# Altium project LORA_NODE_PCB_Project.PrjPcb
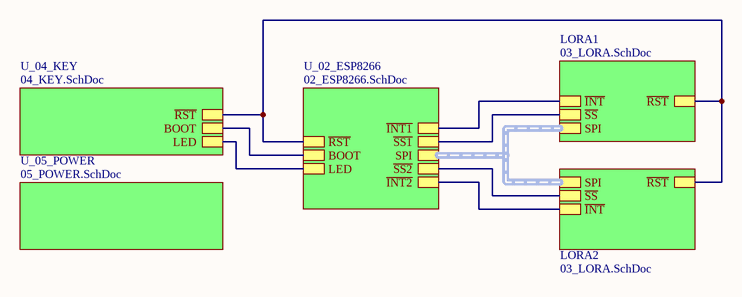
[diagram p0: 01_SYSTEM.SchDoc]
5 sheets, 109 parts. Net scope: hierarchical (ports join the sheet entries above them; power ports are global).
Board files: LORA_NODE.PcbDoc, LORA_NODE2.PcbDoc
Sheets:
  01_SYSTEM.SchDoc
    U_02_ESP8266 = 02_ESP8266.SchDoc
    LORA1 = 03_LORA.SchDoc
    LORA2 = 03_LORA.SchDoc
    U_04_KEY = 04_KEY.SchDoc
    U_05_POWER = 05_POWER.SchDoc

## Sheet 01_SYSTEM.SchDoc: LORA_NODE_SYSYTEM
size A4

### Sub-sheets
LORA1 = 03_LORA.SchDoc: SPI (harness SPI), ~{RST}, ~{SS}, ~{INT}
LORA2 = 03_LORA.SchDoc: SPI (harness SPI), ~{RST}, ~{SS}, ~{INT}
U_02_ESP8266 = 02_ESP8266.SchDoc: SPI (harness SPI), ~{RST}, ~{SS1}, ~{SS2}, BOOT, ~{INT1}, ~{INT2}, LED
U_04_KEY = 04_KEY.SchDoc: ~{RST}, BOOT, LED
U_05_POWER = 05_POWER.SchDoc: no entries

### Nets
DIO0: sheet U_02_ESP8266/~{INT2}, sheet LORA2/~{INT}
DIO0: sheet U_02_ESP8266/~{INT1}, sheet LORA1/~{INT}  [a separate net that carries the same name]
GPIO0: sheet U_02_ESP8266/BOOT, sheet U_04_KEY/BOOT
GPIO16: sheet U_02_ESP8266/LED, sheet U_04_KEY/LED
IO2: sheet U_02_ESP8266/~{SS2}, sheet LORA2/~{SS}
IO15: sheet U_02_ESP8266/~{SS1}, sheet LORA1/~{SS}
nRESET: sheet U_02_ESP8266/~{RST}, sheet LORA1/~{RST}, sheet LORA2/~{RST}, sheet U_04_KEY/~{RST}

### Buses and harness runs
harness sheet LORA1/SPI = sheet LORA2/SPI = sheet U_02_ESP8266/SPI

## Sheet 02_ESP8266.SchDoc
size A4
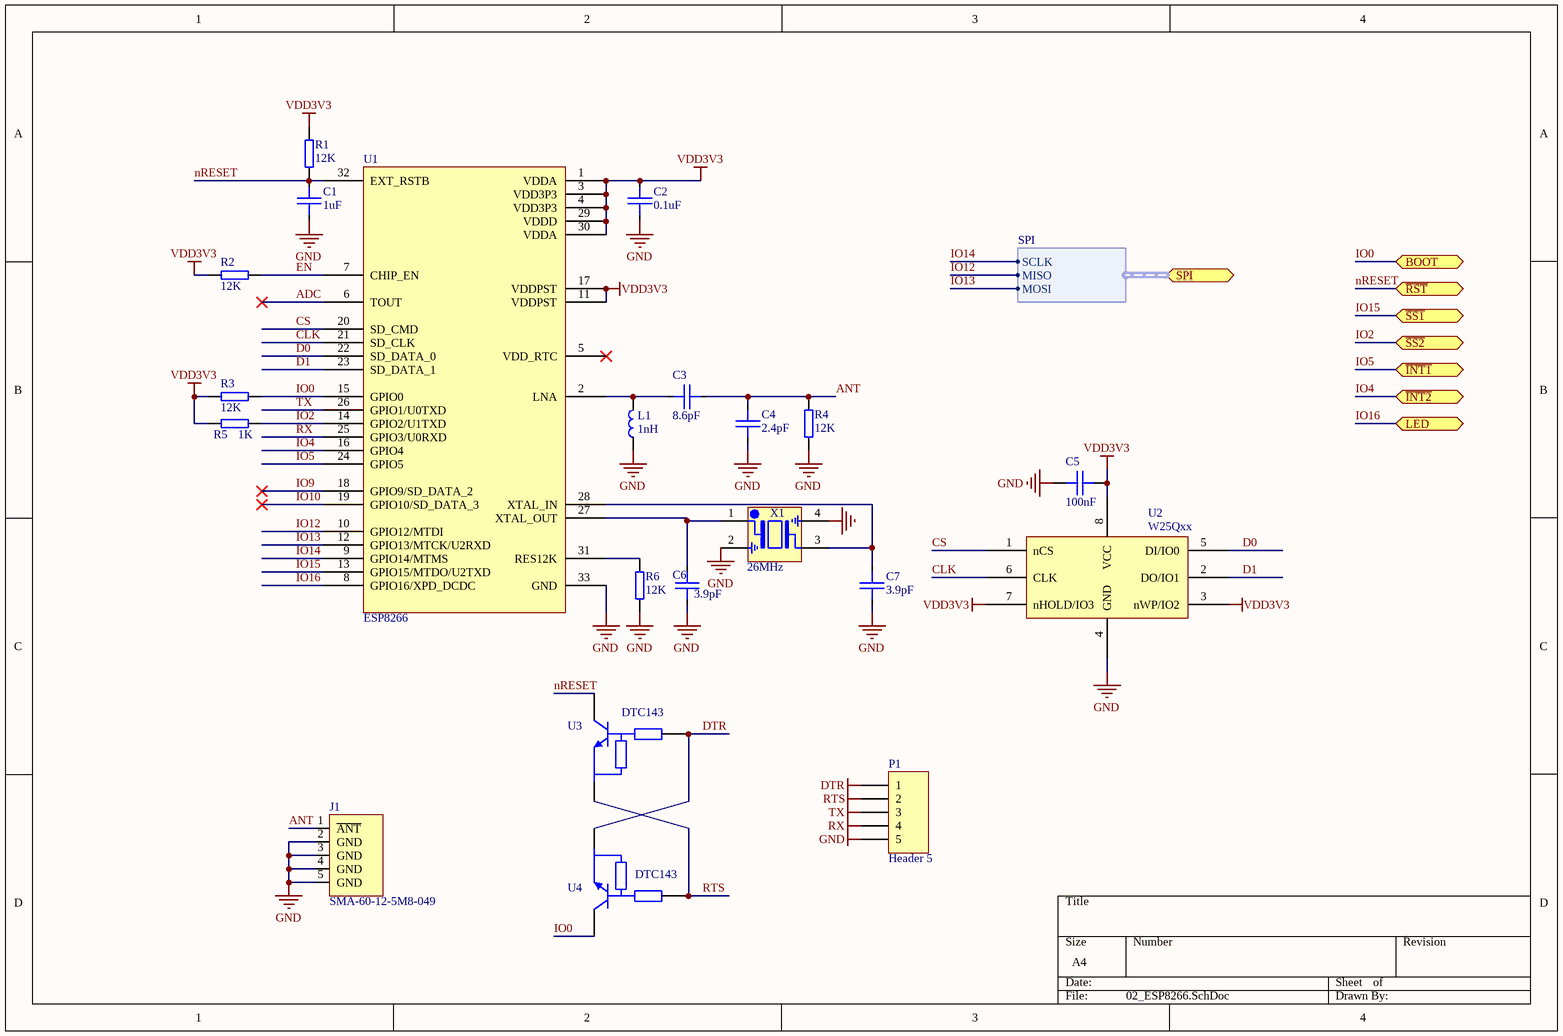
[diagram p1: 02_ESP8266.SchDoc]

### Parts
C1  1uF  [SMT_C_0402]
C2  0.1uF  [SMT_C_0402]
C3  8.6pF  [SMT_C_0402]
C4  2.4pF  [SMT_C_0402]
C5  100nF  [SMT_C_0402]
C6  3.9pF  [SMT_C_0402]
C7  3.9pF  [SMT_C_0402]
J1  SMA-60-12-5M8-049  [SMA-60-12-5M8-049]
L1  1nH  [SMT_L_0402]
P1  Header 5  [HDR1X5]
R1  12K  [SMT_R_0402]
R2  12K  [SMT_R_0402]
R3  12K  [SMT_R_0402]
R4  12K  [SMT_R_0402]
R5  1K  [SMT_R_0402]
R6  12K  [SMT_R_0402]
U1  ESP8266  [QFN32]
U2  W25Qxx  [SOP-8]
U3  DTC143  [SOT23-3]
U4  DTC143  [SOT23-3]
X1  26MHz  [SMT_XTAL_3225]

### Ports
BOOT, LED, SPI (harness SPI), ~{INT1}, ~{INT2}, ~{RST}, ~{SS1}, ~{SS2}

### Harnesses
SPI: MISO, MOSI, SCLK

### Nets
DTR: P1.1 U3.1(B) U4.2(E)
GND: C1.2 C2.2 C4.2 C5.2 C6.2 C7.2 J1.2(GND) J1.3(GND) J1.4(GND) J1.5(GND) L1.2 P1.5 R4.1 R6.2 U1.33(GND) U2.4(GND) X1.2(GND) X1.4(GND)
RTS: P1.2 U3.2(E) U4.1(B)
RX: P1.4 U1.25(GPIO3/U0RXD)
TX: P1.3 U1.26(GPIO1/U0TXD)
VDD3V3: C2.1 C5.1 R1.2 R2.2 R3.2 R5.2 U1.1(VDDA) U1.3(VDD3P3) U1.4(VDD3P3) U1.11(VDDPST) U1.17(VDDPST) U1.29(VDDD) U1.30(VDDA) U2.3(nWP/IO2) U2.7(nHOLD/IO3) U2.8(VCC)
ADC: U1.6(TOUT)
ANT: C3.1 C4.1 J1.1(~{ANT}) R4.2
CLK: U1.21(SD_CLK) U2.6(CLK)
CS: U1.20(SD_CMD) U2.1(nCS)
D0: U1.22(SD_DATA_0) U2.5(DI/IO0)
D1: U1.23(SD_DATA_1) U2.2(DO/IO1)
EN: R2.1 U1.7(CHIP_EN)
IO0: R3.1 U1.15(GPIO0) U4.3(C) ; port BOOT  [project net GPIO0]
IO2: R5.1 U1.14(GPIO2/U1TXD) ; port ~{SS2}
IO4: U1.16(GPIO4) ; port ~{INT2}  [project net DIO0]
IO5: U1.24(GPIO5) ; port ~{INT1}  [project net DIO0]
IO9: U1.18(GPIO9/SD_DATA_2)
IO10: U1.19(GPIO10/SD_DATA_3)
IO12: U1.10(GPIO12/MTDI) ; port SPI.MISO
IO13: U1.12(GPIO13/MTCK/U2RXD) ; port SPI.MOSI
IO14: U1.9(GPIO14/MTMS) ; port SPI.SCLK
IO15: U1.13(GPIO15/MTDO/U2TXD) ; port ~{SS1}
IO16: U1.8(GPIO16/XPD_DCDC) ; port LED  [project net GPIO16]
nRESET: C1.1 R1.1 U1.32(EXT_RSTB) U3.3(C) ; port ~{RST}
NetC3_2: C3.2 L1.1 U1.2(LNA)
NetC6_1: C6.1 U1.27(XTAL_OUT) X1.1(IN/OUT)
NetC7_1: C7.1 U1.28(XTAL_IN) X1.3(IN/OUT)
NetR6_1: R6.1 U1.31(RES12K)

Not connected (* = marked no-connect by the designer): U1 5(VDD_RTC)*

### Library data of the parts
C1-C4 C6 C7 = SMT_C_0402_1: Surface mount capacitor 0402
C5 = SMT_C_0402: Surface mount capacitor 0402
J1 = SMA-60-12-5M8-049: sma 60-12-5M8-049
L1 = SMT_L_0402: Surface mount inductor 0402
P1 = Header 5: Header, 5-Pin; LatestRevisionDate: 17-Jul-2002; LatestRevisionNote: Re-released for DXP Platform.; Publisher: Altium Limited
R1-R6 = SMT_R_0402: Surface mount resistor 0402
U2 = W25Qxx: Serial flash memory with dual and quad SPI
U3 U4 = DTC143: Digital transistors (built-in resistors)
X1 = SMT_XTAL_PASSIVE: Passive crystal

## Sheet 03_LORA.SchDoc
size A4
Used 2 times, as channels LORA1, LORA2. Parts and nets are listed once, with the designators drawn on the sheet.
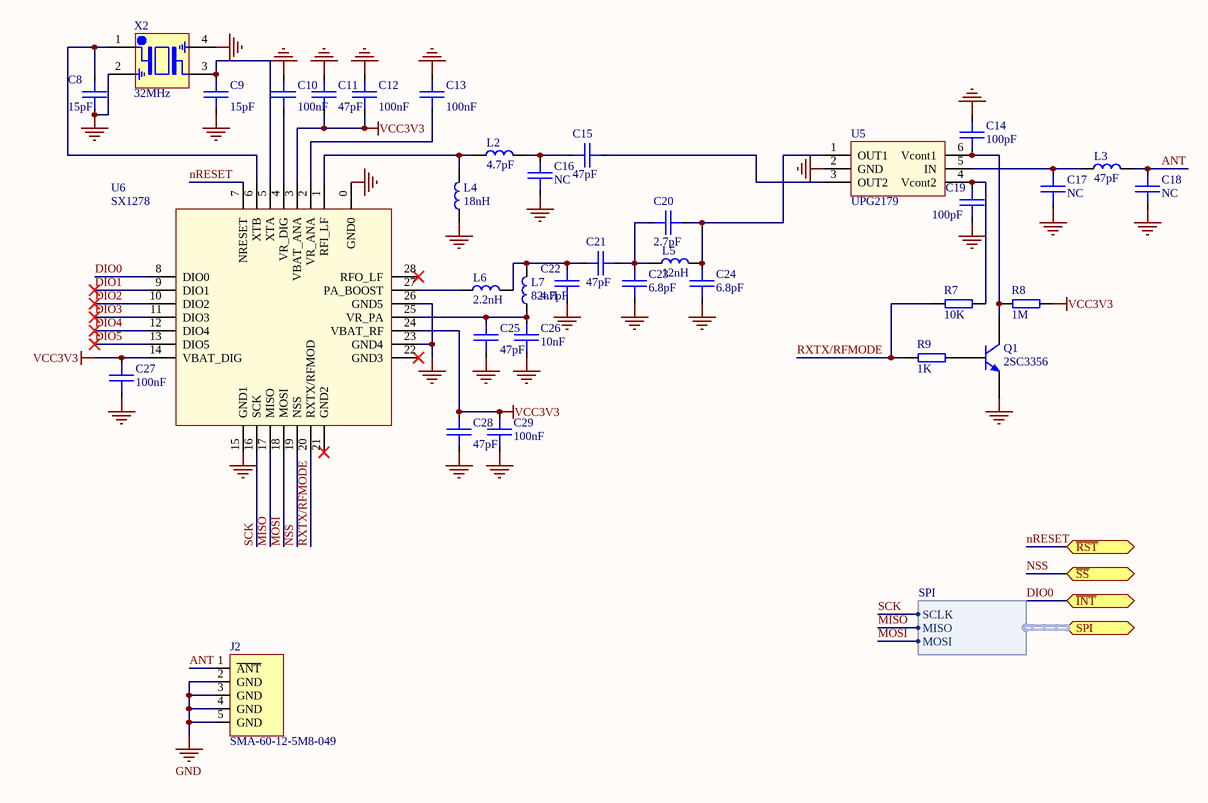
[diagram p2: 03_LORA.SchDoc]

### Parts
C8  15pF  [SMT_C_0402]
C9  15pF  [SMT_C_0402]
C10  100nF  [SMT_C_0402]
C11  47pF  [SMT_C_0402]
C12  100nF  [SMT_C_0402]
C13  100nF  [SMT_C_0402]
C14  100pF  [SMT_C_0402]
C15  47pF  [SMT_C_0402]
C16  NC  [SMT_C_0402]
C17  NC  [SMT_C_0402]
C18  NC  [SMT_C_0402]
C19  100pF  [SMT_C_0402]
C20  2.7pF  [SMT_C_0402]
C21  47pF  [SMT_C_0402]
C22  4.7pF  [SMT_C_0402]
C23  6.8pF  [SMT_C_0402]
C24  6.8pF  [SMT_C_0402]
C25  47pF  [SMT_C_0402]
C26  10nF  [SMT_C_0402]
C27  100nF  [SMT_C_0402]
C28  47pF  [SMT_C_0402]
C29  100nF  [SMT_C_0402]
J2  SMA-60-12-5M8-049  [SMA-60-12-5M8-049]
L2  4.7pF  [SMT_L_0402]
L3  47pF  [SMT_L_0402]
L4  18nH  [SMT_L_0402]
L5  12nH  [SMT_L_0402]
L6  2.2nH  [SMT_L_0402]
L7  82nH  [SMT_L_0402]
Q1  2SC3356  [SOT-23S]
R7  10K  [SMT_R_0402]
R8  1M  [SMT_R_0402]
R9  1K  [SMT_R_0402]
U5  UPG2179  [SC70-6]
U6  SX1278  [QFN28-6x6]
X2  32MHz  [SMT_XTAL_3225]

### Ports
SPI (harness SPI), ~{INT}, ~{RST}, ~{SS}

### Harnesses
SPI: MISO, MOSI, SCLK

### Nets
GND: C8.1 C9.1 C10.2 C11.1 C12.2 C13.2 C14.2 C16.1 C17.1 C18.1 C19.1 C22.1 C23.1 C24.1 C25.1 C26.1 C27.2 C28.1 C29.1 J2.2(GND) J2.3(GND) J2.4(GND) J2.5(GND) L4.2 Q1.2(E) U5.2(GND) U6.0(GND0) U6.15(GND1) U6.23(GND4) U6.26(GND5) X2.2(GND) X2.4(GND)
VCC3V3: C11.2 C12.1 C27.1 C28.2 C29.2 R8.2 U6.3(VBAT_ANA) U6.14(VBAT_DIG) U6.24(VBAT_RF)
ANT: C18.2 J2.1(~{ANT}) L3.1
DIO0: U6.8(DIO0) ; port ~{INT}
DIO1: U6.9(DIO1)
DIO2: U6.10(DIO2)
DIO3: U6.11(DIO3)
DIO4: U6.12(DIO4)
DIO5: U6.13(DIO5)
MISO: U6.17(MISO) ; port SPI.MISO
MOSI: U6.18(MOSI) ; port SPI.MOSI
nRESET: U6.7(NRESET) ; port ~{RST}
NSS: U6.19(NSS) ; port ~{SS}
RXTX/RFMODE: R7.1 R9.1 U6.20(RXTX/RFMOD)
SCK: U6.16(SCK) ; port SPI.SCLK
NetC8_2: C8.2 U6.6(XTB) X2.1(IN/OUT)
NetC9_2: C9.2 U6.5(XTA) X2.3(IN/OUT)
NetC10_1: C10.1 U6.4(VR_DIG)
NetC13_1: C13.1 U6.2(VR_ANA)
NetC14_1: C14.1 Q1.3(C) R8.1 U5.6(Vcont1)
NetC15_1: C15.1 U5.3(OUT2)
NetC15_2: C15.2 C16.2 L2.1
NetC17_2: C17.2 L3.2 U5.5(IN)
NetC19_2: C19.2 R7.2 U5.4(Vcont2)
NetC20_1: C20.1 C21.2 C23.2 L5.2
NetC20_2: C20.2 C24.2 L5.1 U5.1(OUT1)
NetC21_1: C21.1 C22.2 L6.1 L7.1
NetC25_2: C25.2 C26.2 L7.2 U6.25(VR_PA)
NetL2_2: L2.2 L4.1 U6.1(RFI_LF)
NetL6_2: L6.2 U6.27(PA_BOOST)
NetQ1_1: Q1.1(B) R9.2

Not connected (* = marked no-connect by the designer): U6 21(GND2)* 22(GND3)* 28(RFO_LF)*

### Channels
LORA1: designators end in _LORA1; ports ~{INT}=DIO0 ~{RST}=nRESET ~{SS}=IO15
LORA2: designators end in _LORA2; ports ~{INT}=DIO0 ~{RST}=nRESET ~{SS}=IO2

### Library data of the parts
C8-C29 = SMT_C_0402_1: Surface mount capacitor 0402
J2 = SMA-60-12-5M8-049: sma 60-12-5M8-049
L2-L7 = SMT_L_0402: Surface mount inductor 0402
Q1 = NPN: NPN Bipolar Transistor; Published: 8-Jun-2000; LatestRevisionDate: 17-Jul-2002; LatestRevisionNote: Re-released for DXP Platform.; PackageReference: TO-226-AA; Publisher: Altium Limited; PackageDescription: TO, Flat Index; 3 In-Line, Axial Leads; Body Dia. 4.8mm; Leads 0.55 x 0.51 mm (max); Code_JEDEC: TO-226-AA
R7-R9 = SMT_R_0402: Surface mount resistor 0402
X2 = SMT_XTAL_PASSIVE: Passive crystal

## Sheet 04_KEY.SchDoc
size A4
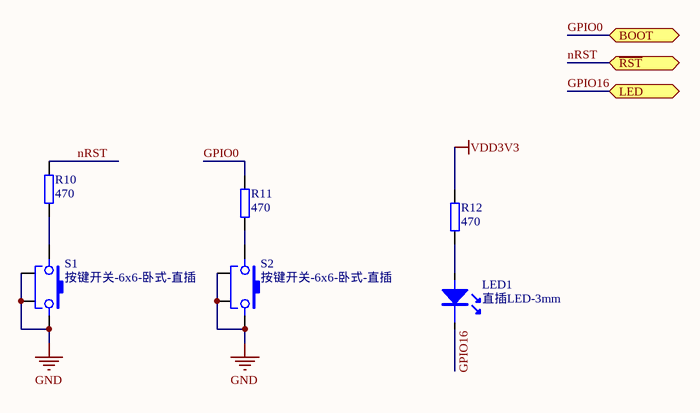
[diagram p3: 04_KEY.SchDoc]

### Parts
LED1  直插LED-3mm  [直插LED-3mm]
R10  470  [SMT_R_0402]
R11  470  [SMT_R_0402]
R12  470  [SMT_R_0402]
S1  按键开关-6x6-卧式-直插  [按键开关-6x6-卧式-直插]
S2  按键开关-6x6-卧式-直插  [按键开关-6x6-卧式-直插]

### Ports
BOOT, LED, ~{RST}

### Nets
GND: S1.2(PIN2) S1.3 S1.4 S2.2(PIN2) S2.3 S2.4
VDD3V3: R12.1
GPIO0: R11.2 ; port BOOT
GPIO16: LED1.2(K) ; port LED
nRST: R10.2 ; port ~{RST}  [project net nRESET]
NetLED1_1: LED1.1(A) R12.2
NetR10_1: R10.1 S1.1(PIN1)
NetR11_1: R11.1 S2.1(PIN1)

### Library data of the parts
R10-R12 = SMT_R_0402: Surface mount resistor 0402

## Sheet 05_POWER.SchDoc
size A4
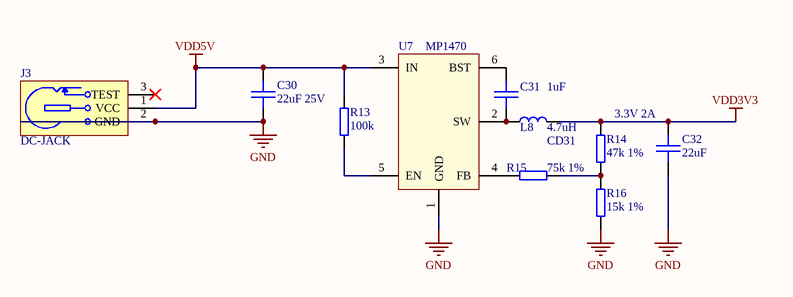
[diagram p4: 05_POWER.SchDoc]

### Parts
C30  22uF 25V  [SMT_C_0805]
C31  1uF  [SMT_C_0402]
C32  22uF  [SMT_C_0805]
J3  DC-JACK  [DC-JACK-6.2mm]
L8  4.7uH  [SMT_L_3.3mm]
R13  100k  [SMT_R_0402]
R14  47k 1%  [SMT_R_0402]
R15  75k 1%  [SMT_R_0402]
R16  15k 1%  [SMT_R_0402]
U7  MP1470  [SOT23-6]

### Nets
GND: C30.2 C32.2 J3.2(GND) R16.2 U7.1(GND)
VDD3V3: C32.1 L8.1 R14.1
VDD5V: C30.1 J3.1(VCC) R13.2 U7.3(IN)
NetC31_1: C31.1 U7.6(BST)
NetC31_2: C31.2 L8.2 U7.2(SW)
NetR13_1: R13.1 U7.5(EN)
NetR14_2: R14.2 R15.1 R16.1
NetR15_2: R15.2 U7.4(FB)

Not connected (* = marked no-connect by the designer): J3 3(TEST)*

### Notes on the sheet
- 3.3V 2A
- (near L8) CD31

### Library data of the parts
C30 C32 = SMT_C_0805: Surface mount capacitor 0805
C31 = SMT_C_0402: Surface mount capacitor 0402
J3 = DC-JACK: 电源插孔
L8 = SMT_L_3.3mm: LPO3310 SMT Power Inductor, 3.3x3.3x1mm
R13-R16 = SMT_R_0402: Surface mount resistor 0402
U7 = MP1470: High-Efficiency, 2A, 16V, 500kHz  Synchronous, Step-Down Converter

## Nets that join several sheets
GND: 02_ESP8266 (18 pins), LORA1 (32 pins), LORA2 (32 pins), 04_KEY (6 pins), 05_POWER (5 pins)
VCC3V3: LORA1 (9 pins), LORA2 (9 pins)
VDD3V3: 02_ESP8266 (16 pins), 04_KEY (R12.1), 05_POWER (C32.1 L8.1 R14.1)
DIO0: 02_ESP8266 (U1.16), LORA2 (U6_LORA2.8)
DIO0: 02_ESP8266 (U1.24), LORA1 (U6_LORA1.8)
GPIO0: 02_ESP8266 (R3.1 U1.15 U4.3), 04_KEY (R11.2)
GPIO16: 02_ESP8266 (U1.8), 04_KEY (LED1.2)
IO2: 02_ESP8266 (R5.1 U1.14), LORA2 (U6_LORA2.19)
IO12: 02_ESP8266 (U1.10), LORA1 (U6_LORA1.17), LORA2 (U6_LORA2.17)
IO13: 02_ESP8266 (U1.12), LORA1 (U6_LORA1.18), LORA2 (U6_LORA2.18)
IO14: 02_ESP8266 (U1.9), LORA1 (U6_LORA1.16), LORA2 (U6_LORA2.16)
IO15: 02_ESP8266 (U1.13), LORA1 (U6_LORA1.19)
nRESET: 02_ESP8266 (C1.1 R1.1 U1.32 U3.3), LORA1 (U6_LORA1.7), LORA2 (U6_LORA2.7), 04_KEY (R10.2)